# Altium project 定位NBIOT V1.2.PrjPCB
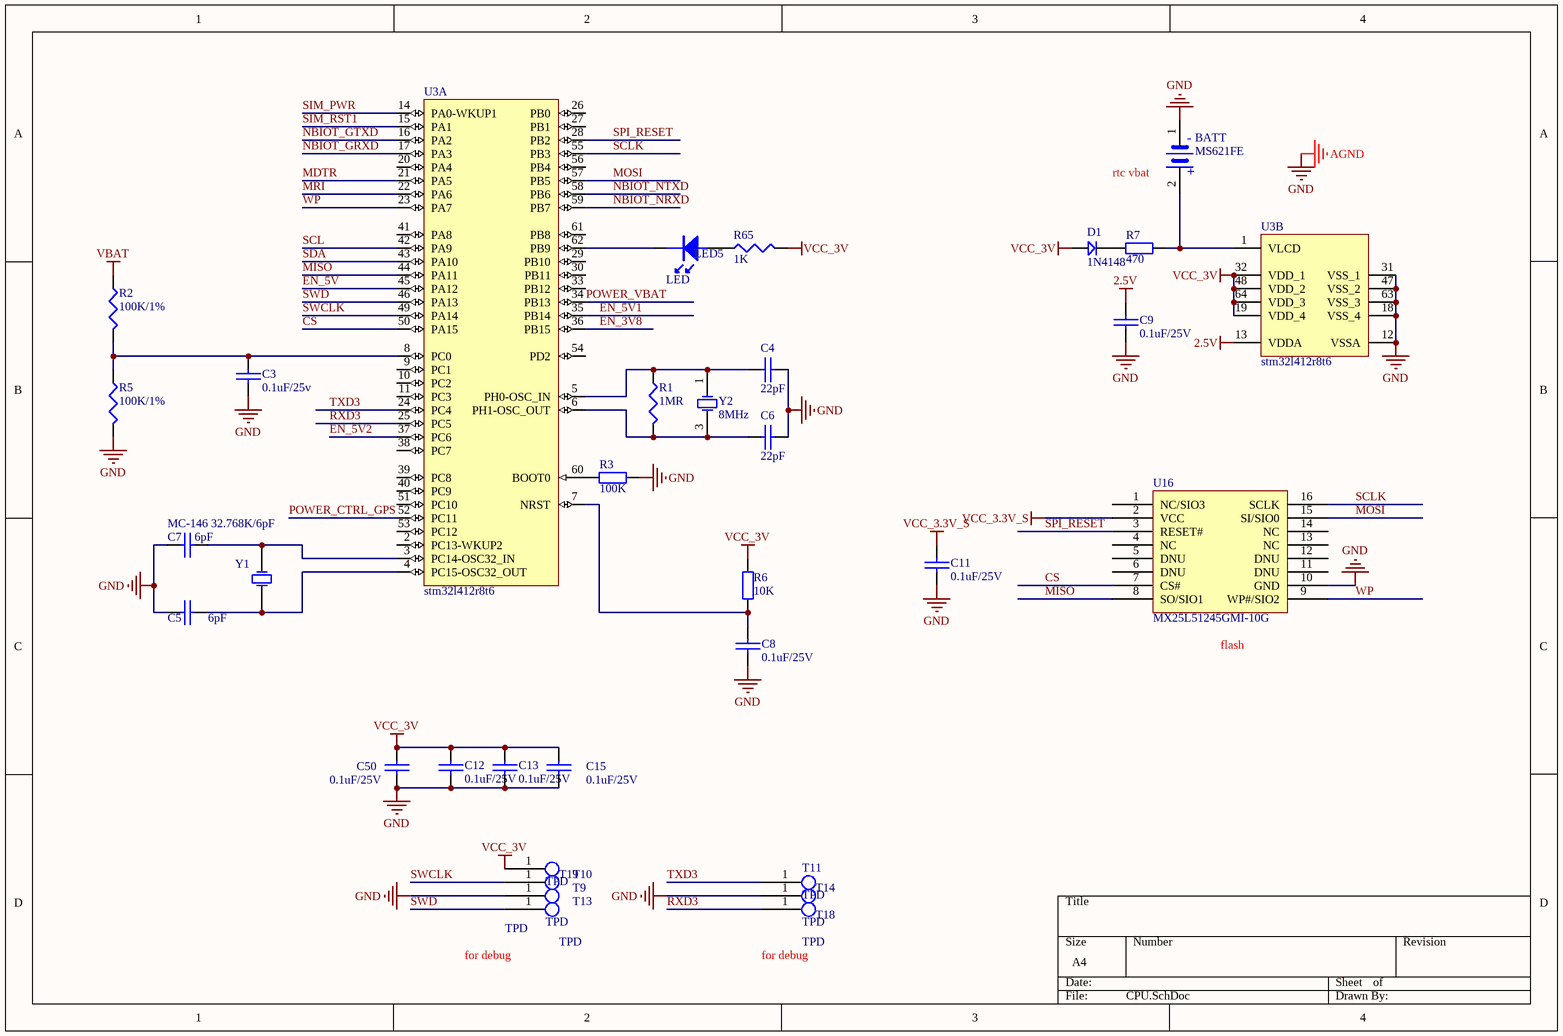
[diagram p0: CPU.SchDoc]
6 sheets, 149 parts. Net scope: global (net labels, ports and power ports of the same name join across sheets).
Board file: PCB1.1.PcbDoc
Sheets:
  CPU.SchDoc
  sensors.SchDoc
  power.SchDoc
  4G.SchDoc
  GPS&&lte2.SchDoc
  NBIOT.SchDoc

## Sheet CPU.SchDoc
size A4

### Parts
BATT  MS621FE  [MS621FE]
C3  0.1uF/25v  [0402c]
C4  22pF  [0402c]
C5  6pF  [0402c]
C6  22pF  [0402c]
C7  6pF  [0402c]
C8  0.1uF/25V  [0402C]
C9  0.1uF/25V  [0402C]
C11  0.1uF/25V  [0402C]
C12  0.1uF/25V  [0402C]
C13  0.1uF/25V  [0402C]
C15  0.1uF/25V  [0402C]
C50  0.1uF/25V  [0402C]
D1  1N4148  [DIODE_SOP]
LED5  LED  [0603LED]
R1  1MR  [0402R]
R2  100K/1%  [0402R]
R3  100K  [0402R]
R5  100K/1%  [0402R]
R6  10K  [0402R]
R7  470  [0402R]
R65  1K  [0402R]
T9  TPD  [TPd]
T10  TPD  [TPd]
T11  TPD  [TPd]
T13  TPD  [TPd]
T14  TPD  [TPd]
T18  TPD  [TPd]
T19  TPD  [TPd]
U3  stm32l412r8t6  [LQFP-64]  (parts A,B of 2)
U16  MX25L51245GMI-10G  [SOP127P1030X239-16N]
Y1  MC-146 32.768K/6pF  [32.768K]
Y2  8MHz  [OSCILLATOR-3.2X2.5]

### Nets
2.5V: C9.2 U3.13(VDDA)
AGND: BATT.1 C3.2 C4.1 C5.2 C6.1 C7.2 C8.1 C9.1 C11.1 C12.1 C13.1 C15.1 C50.1 R3.2 R5.2 T13.1 T14.1 U3.12(VSSA) U3.18(VSS_4) U3.31(VSS_1) U3.47(VSS_2) U3.63(VSS_3) U16.10(GND)  [also labelled GND]
VBAT: R2.1
VCC_3.3V_S: C11.2 U16.2(VCC)
VCC_3V: C12.2 C13.2 C15.2 C50.2 D1.1 R6.1 R65.2 T19.1 U3.19(VDD_4) U3.32(VDD_1) U3.48(VDD_2) U3.64(VDD_3)
CS: U3.50(PA15) U16.7(CS#)
EN_3V8: U3.36(PB15)
EN_5V: U3.45(PA12)
EN_5V1: U3.35(PB14)
EN_5V2: U3.37(PC6)
MDTR: U3.21(PA5)
MISO: U3.44(PA11) U16.8(SO/SIO1)
MOSI: U3.57(PB5) U16.15(SI/SIO0)
MRI: U3.22(PA6)
NBIOT_GRXD: U3.17(PA3)
NBIOT_GTXD: U3.16(PA2)
NBIOT_NRXD: U3.59(PB7)
NBIOT_NTXD: U3.58(PB6)
POWER_CTRL_GPS: U3.52(PC11)
POWER_VBAT: U3.34(PB13)
RXD3: T18.1 U3.25(PC5)
SCL: U3.42(PA9)
SCLK: U3.55(PB3) U16.16(SCLK)
SDA: U3.43(PA10)
SIM_PWR: U3.14(PA0-WKUP1)
SIM_RST1: U3.15(PA1)
SPI_RESET: U3.28(PB2) U16.3(RESET#)
SWCLK: T10.1 U3.49(PA14)
SWD: T9.1 U3.46(PA13)
TXD3: T11.1 U3.24(PC4)
WP: U3.23(PA7) U16.9(WP#/SIO2)
NetBATT_2: BATT.2 R7.2 U3.1(VLCD)
NetC3_1: C3.1 R2.2 R5.1 U3.8(PC0)
NetC4_2: C4.2 R1.1 U3.5(PH0-OSC_IN) Y2.1(OSC1)
NetC5_1: C5.1 U3.4(PC15-OSC32_OUT) Y1.2(OSC2)
NetC6_2: C6.2 R1.2 U3.6(PH1-OSC_OUT) Y2.3(OSC2)
NetC7_1: C7.1 U3.3(PC14-OSC32_IN) Y1.1(OSC1)
NetC8_2: C8.2 R6.2 U3.7(NRST)
NetD1_2: D1.2 R7.1
NetLED5_1: LED5.1 R65.1
NetLED5_2: LED5.2 U3.62(PB9)
NetR3_1: R3.1 U3.60(BOOT0)

Not connected (* = marked no-connect by the designer): U3 2(PC13-WKUP2) 9(PC1) 10(PC2) 11(PC3) 20(PA4) 26(PB0) 27(PB1) 29(PB10) 30(PB11) 33(PB12) 38(PC7) 39(PC8) 40(PC9) 41(PA8) 51(PC10) 53(PC12) 54(PD2) 56(PB4) 61(PB8); U16 1(NC/SIO3) 4(NC) 5(DNU) 6(DNU) 11(DNU) 12(DNU) 13(NC) 14(NC)

### Notes on the sheet
- (near BATT) rtc vbat
- (near U16) flash
- for debug
- (in symbol SBatery) -; +

### Library data of the parts
BATT = SBatery
C3-C9 C11-C13 C15 C50 = CAP: Capacitor
D1 = D
R1 = Res3: Resistor; Published: 8-Jun-2000; LatestRevisionDate: 29-May-2009; LatestRevisionNote: IPC-7351 Footprint Added.; PackageReference: J1-0603; Publisher: Altium Limited; PackageDescription: Chip Resistor
R2 R5 R65 = RES1: P: 1/8W
R3 R6 R7 = Res2: Resistor; Value: 1K; Published: 8-Jun-2000; LatestRevisionDate: 17-Jul-2002; LatestRevisionNote: Re-released for DXP Platform.; PackageReference: AXIAL-0.4; Publisher: Altium Limited
U3 = STM32L100R8T6: ARM Cortex-M3 32-bit MCU, 64 KB Flash, 8 KB Internal RAM, 51 I/Os, 64-pin LQFP, -40 to 85 degC, Tray; Manufacturer: STMicroelectronics; D/A Converter: 2x12-bit (2 Channel); Data E2PROM nom (B): 2048; Display controller: LCD 4x32/8x28; FLASH Size (Prog) (kB): 64; I/Os (High Current): 51; Internal RAM Size (kB): 8; Operating Frequency(F) (Processor speed) (MHz): 32; Supply Voltage(Vcc) min (V): 1.8; DatasheetVersion: Rev. 1; PackageVersion: Rev. 4, 06/2013; PackageReference: LQFP64; PackageDescription: 64-Pin Low Profile Quad Flat Package, 10 x 10 mm Body, 0.5 mm Pitch; Core: ARM Cortex-M3; Packing: Tray; Mounting Technology: Surface Mount; PartNumber: STM32L100R8T6; ComponentLink1Description: Manufacturer URL; ComponentLink1URL: http://www.st.com/web/en/home.html; ComponentLink2Description: Datasheet; ComponentLink2URL: http://www.st.com/st-web-ui/static/active/en/resource/technical/document/datasheet/DM00078075.pdf; ComponentLink3Description: Package Specification; ComponentLink3URL: http://www.st.com/st-web-ui/static/active/en/resource/technical/document/datasheet/DM00037051.pdf
Y1 Y2 = XTAL: Crystal Oscillator; Published: 8-Jun-2000; LatestRevisionDate: 17-Jul-2002; LatestRevisionNote: Re-released for DXP Platform.; PackageReference: R38; Publisher: Altium Limited
  Y2: PackageDescription: Crystal, Thru-Hole; 2 Leads; Body 3.1 x 8.2 mm (Dia.xH)

## Sheet sensors.SchDoc
size A4
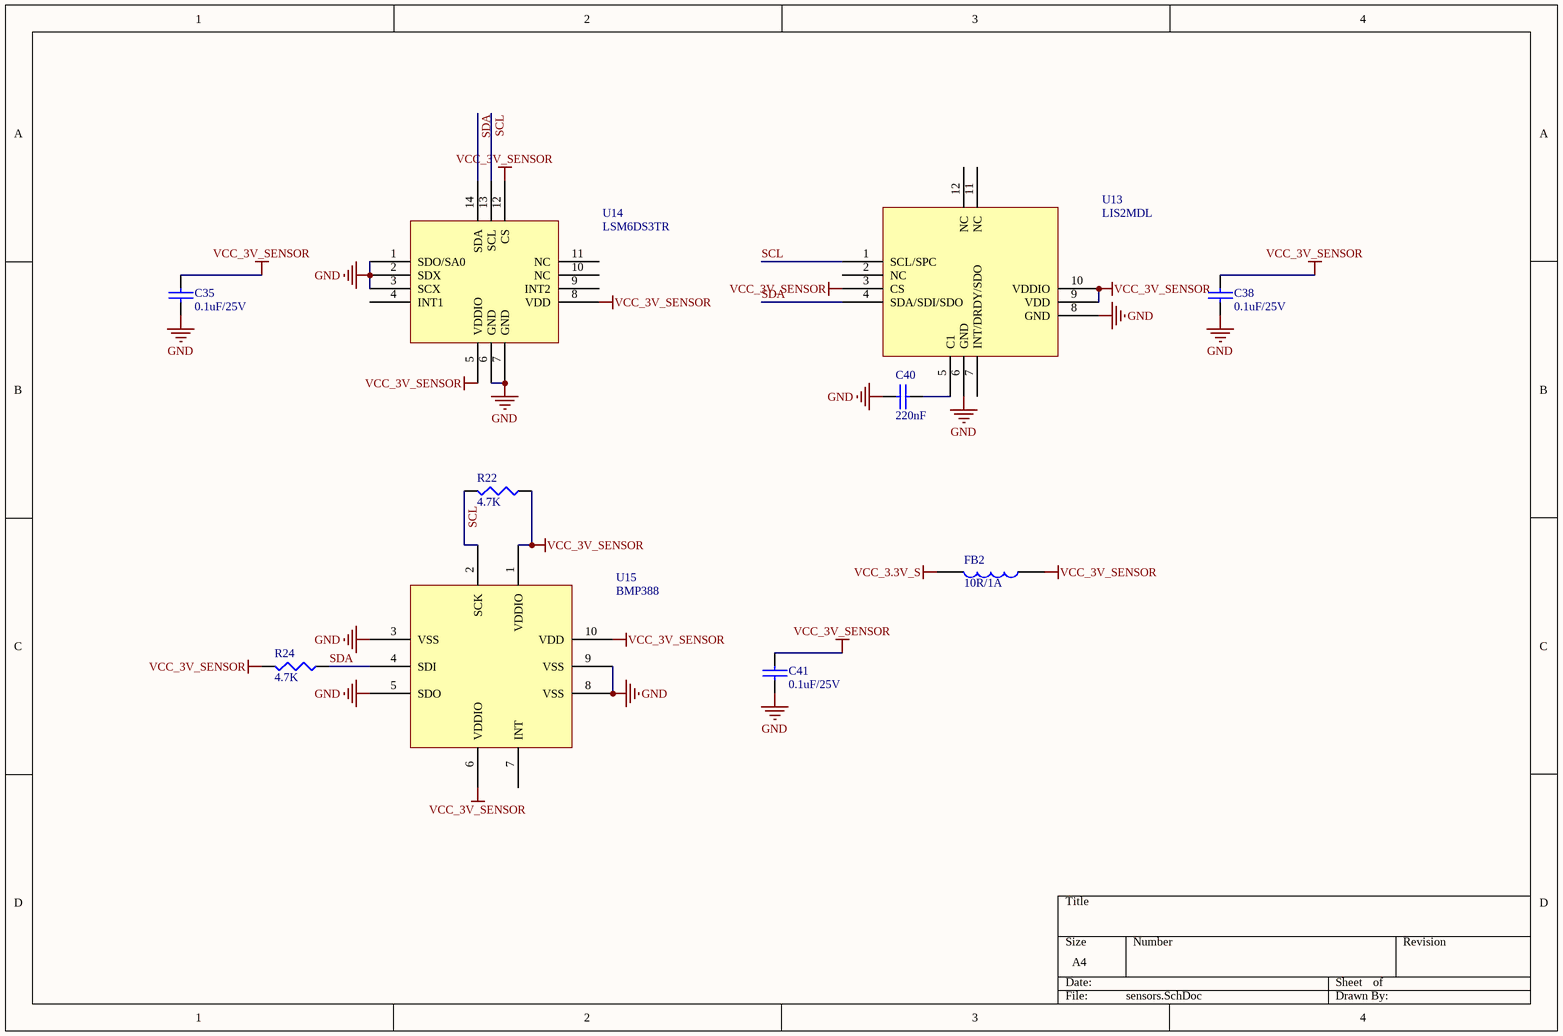
[diagram p1: sensors.SchDoc]

### Parts
C35  0.1uF/25V  [0402C]
C38  0.1uF/25V  [0402C]
C40  220nF  [0402c]
C41  0.1uF/25V  [0402C]
FB2  10R/1A  [0603R]
R22  4.7K  [0402R]
R24  4.7K  [0402R]
U13  LIS2MDL  [LIS2MDL]
U14  LSM6DS3TR  [LSM6DS3TR-C]
U15  BMP388  [BMP388]

### Nets
GND: C35.1 C38.1 C40.2 C41.1 U13.6(GND) U13.8(GND) U14.1(SDO/SA0) U14.2(SDX) U14.3(SCX) U14.6(GND) U14.7(GND) U15.3(VSS) U15.5(SDO) U15.8(VSS) U15.9(VSS)  [project net AGND]
VCC_3.3V_S: FB2.1
VCC_3V_SENSOR: C35.2 C38.2 C41.2 FB2.2 R22.1 R24.2 U13.3(CS) U13.9(VDD) U13.10(VDDIO) U14.5(VDDIO) U14.8(VDD) U14.12(CS) U15.1(VDDIO) U15.6(VDDIO) U15.10(VDD)
SCL: R22.2 U13.1(SCL/SPC) U14.13(SCL) U15.2(SCK)
SDA: R24.1 U13.4(SDA/SDI/SDO) U14.14(SDA) U15.4(SDI)
NetC40_1: C40.1 U13.5(C1)

Not connected (* = marked no-connect by the designer): U13 2(NC) 7(INT/DRDY/SDO) 11(NC) 12(NC); U14 4(INT1) 9(INT2) 10(NC) 11(NC); U15 7(INT)

### Library data of the parts
C35 C38 C40 C41 = CAP: Capacitor
FB2 = INDUCTOR1
R22 R24 = RES1: P: 1/8W

## Sheet power.SchDoc
size A3
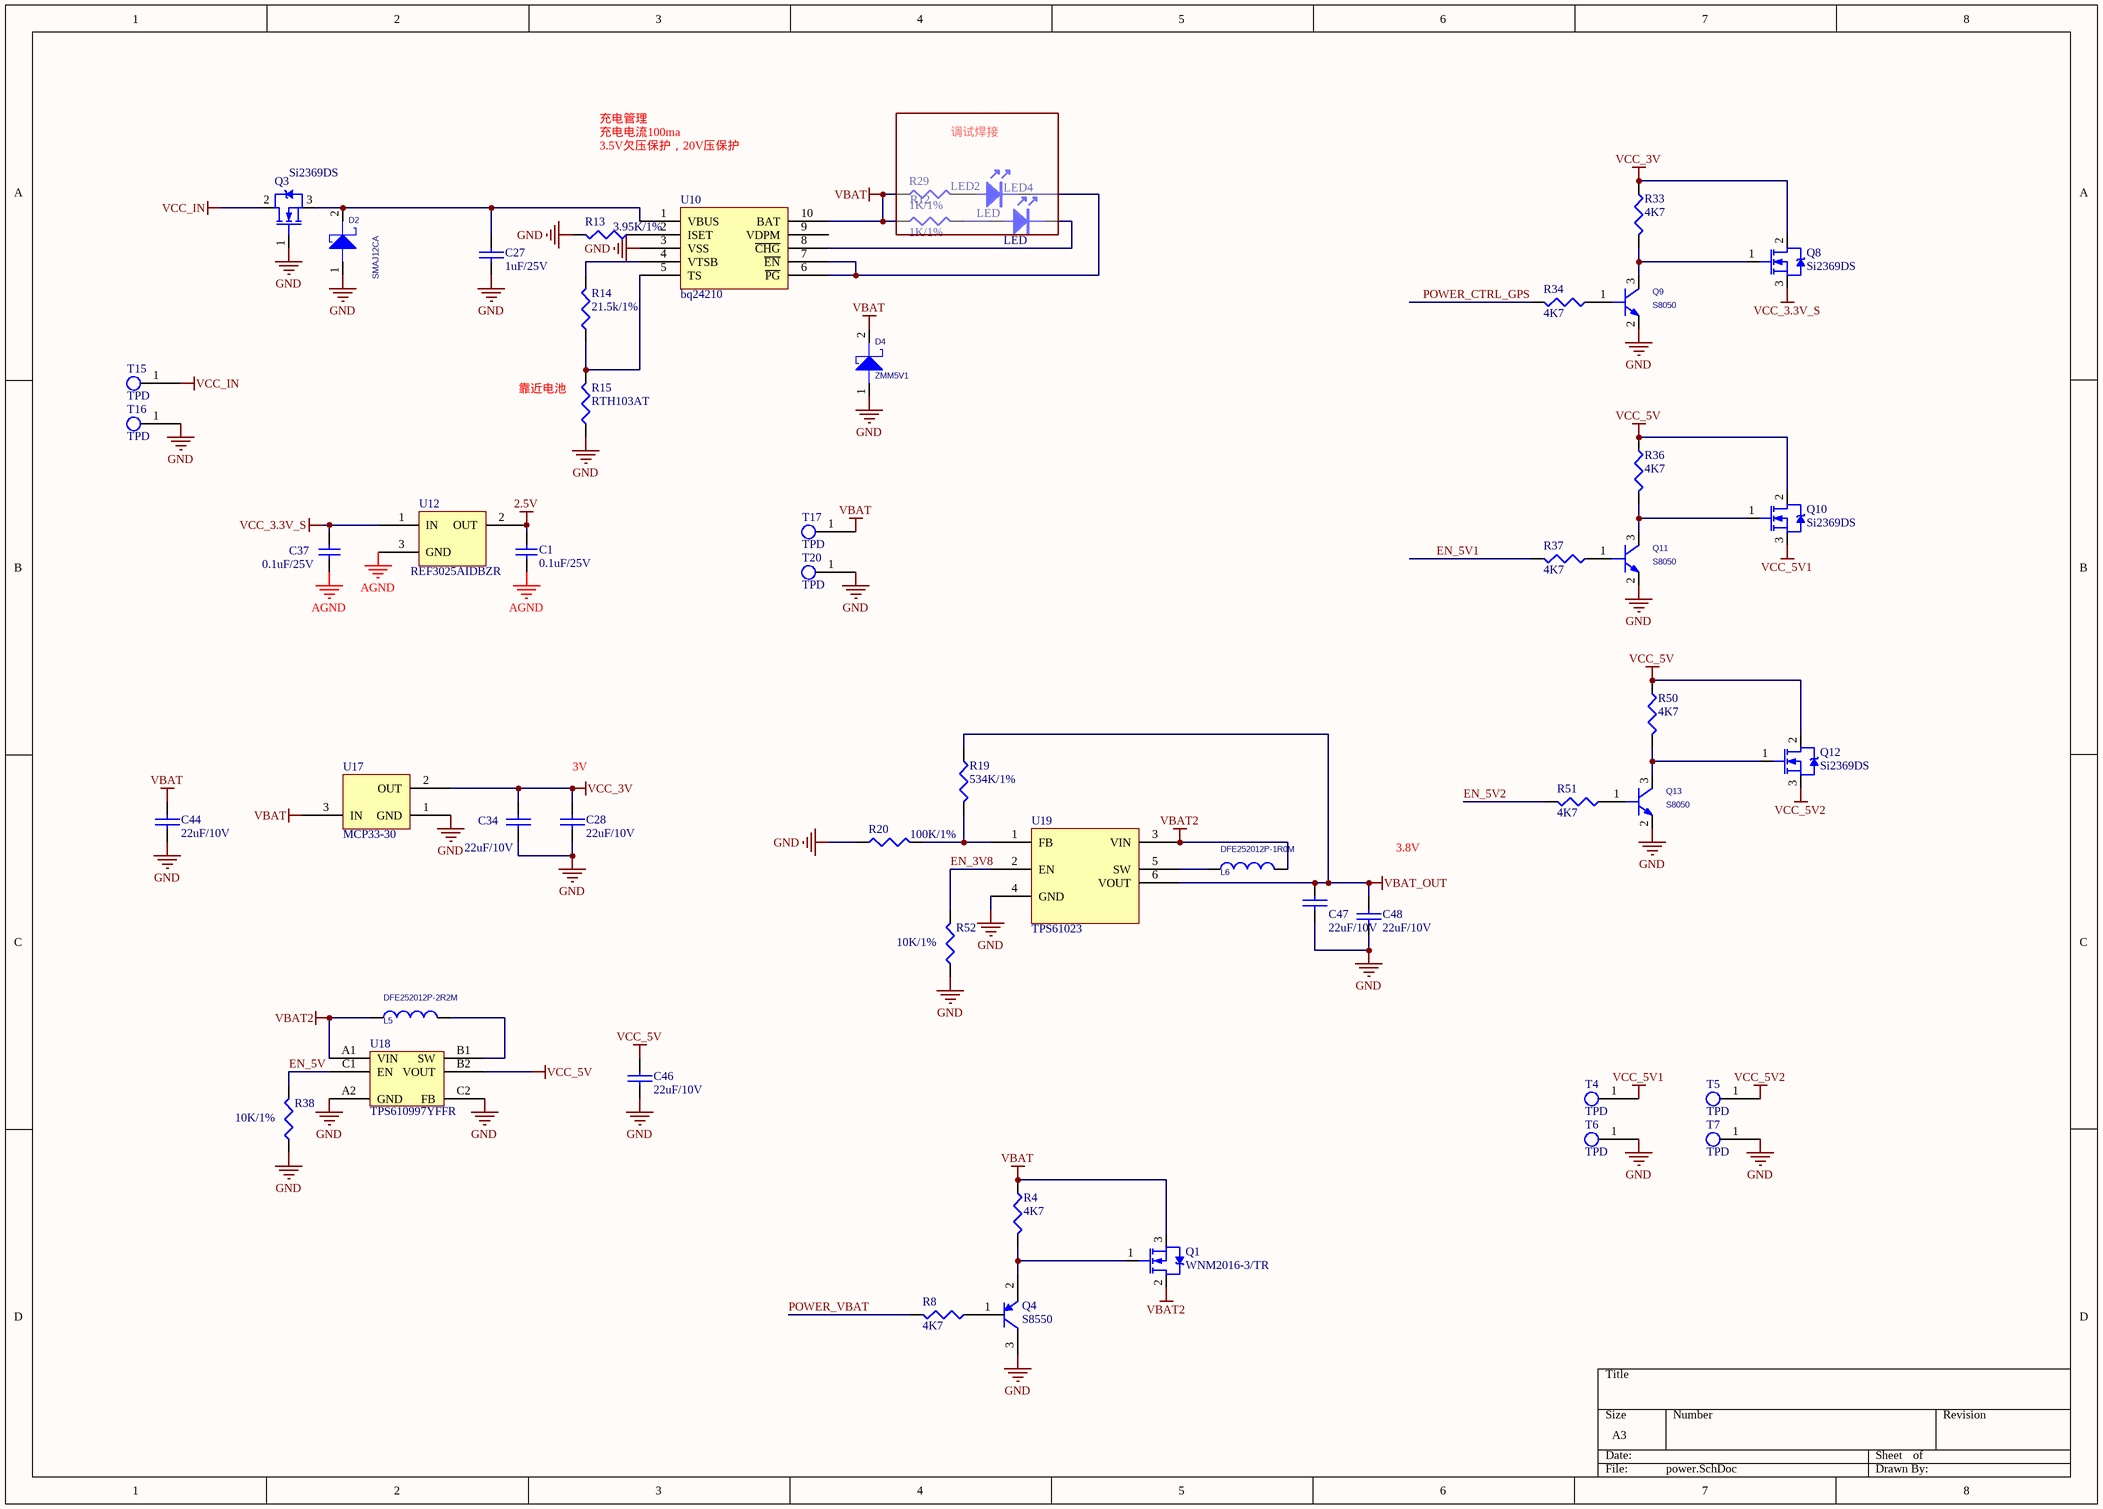
[diagram p2: power.SchDoc]

### Parts
C1  0.1uF/25V  [0402c]
C27  1uF/25V  [0402C]
C28  22uF/10V  [0805C]
C34  22uF/10V  [0805C]
C37  0.1uF/25V  [0402c]
C44  22uF/10V  [0805C]
C46  22uF/10V  [0805C]
C47  22uF/10V  [0805C]
C48  22uF/10V  [0805C]
D2  SMAJ12CA  [SMA]
D4  value ZMM5V1  [LL-34(D1206)]  (hidden comment: DIODE_SCHOTTKY_0)
L5  DFE252012P-2R2M  [L2520]
L6  DFE252012P-1R0M  [L2520]
LED2  LED  [0603LED]
LED4  LED  [0603LED]
Q1  WNM2016-3/TR  [sot23-3]
Q3  Si2369DS  [sot23-3]
Q4  S8550  [SOT95P240-3N]
Q8  Si2369DS  [sot23-3]
Q9  S8050  [SOT23-3]
Q10  Si2369DS  [sot23-3]
Q11  S8050  [SOT23-3]
Q12  Si2369DS  [sot23-3]
Q13  S8050  [SOT23-3]
R4  4K7  [0402R]
R8  4K7  [0402R]
R12  1K/1%  [0402R]
R13  3.95K/1%  [0402R]
R14  21.5k/1%  [0402R]
R15  RTH103AT  [0603R]
R19  534K/1%  [0402R]
R20  100K/1%  [0402R]
R29  1K/1%  [0402R]
R33  4K7  [0402R]
R34  4K7  [0402R]
R36  4K7  [0402R]
R37  4K7  [0402R]
R38  10K/1%  [0402R]
R50  4K7  [0402R]
R51  4K7  [0402R]
R52  10K/1%  [0402R]
T4  TPD  [TP]
T5  TPD  [TP]
T6  TPD  [TP]
T7  TPD  [TP]
T15  TPD  [TP]
T16  TPD  [TP]
T17  TPD  [TP]
T20  TPD  [TP]
U10  bq24210  [QFN50P200X300X80-10N]
U12  REF3025AIDBZR  [SOT23-3]
U17  MCP33-30  [SOT23-3]
U18  TPS610997YFFR  [TPS610997YFFR]
U19  TPS61023  [SOT563-6]

### Blocks framed on the sheet
调试焊接: LED2 LED4 R12 R29

### Nets
2.5V: C1.1 U12.2(OUT)
AGND: C1.2 C27.2 C28.2 C34.2 C37.2 C44.2 C46.2 C47.2 C48.2 D2.1 D4.1 Q3.1(G) Q4.3(C) Q9.2(E) Q11.2(E) Q13.2(E) R13.2 R15.1 R20.1 R38.1 R52.1 T6.1 T7.1 T16.1 T20.1 U10.3(VSS) U12.3(GND) U17.1(GND) U18.A2(GND) U18.C2(FB) U19.4(GND)  [also labelled GND]
VBAT: C44.1 D4.2 Q1.3(S) R4.1 R12.1 R29.1 T17.1 U10.10(BAT) U17.3(IN)
VBAT2: L5.1 L6.2 Q1.2(D) U18.A1(VIN) U19.3(VIN)
VBAT_OUT: C47.1 C48.1 R19.1 U19.6(VOUT)
VCC_3.3V_S: C37.1 Q8.3(S) U12.1(IN)
VCC_3V: C28.1 C34.1 Q8.2(D) R33.1 U17.2(OUT)
VCC_5V: C46.1 Q10.2(D) Q12.2(D) R36.1 R50.1 U18.B2(VOUT)
VCC_5V1: Q10.3(S) T4.1
VCC_5V2: Q12.3(S) T5.1
VCC_IN: Q3.2(D) T15.1
EN_3V8: R52.2 U19.2(EN)
EN_5V: R38.2 U18.C1(EN)
EN_5V1: R37.2
EN_5V2: R51.2
POWER_CTRL_GPS: R34.2
POWER_VBAT: R8.2
NetC27_1: C27.1 D2.2 Q3.3(S) U10.1(VBUS)
NetL5_2: L5.2 U18.B1(SW)
NetL6_1: L6.1 U19.5(SW)
NetLED2_1: LED2.1 R29.2
NetLED2_2: LED2.2 U10.6(~{PG}) U10.7(~{EN})
NetLED4_1: LED4.1 R12.2
NetLED4_2: LED4.2 U10.8(~{CHG})
NetQ1_1: Q1.1(G) Q4.2(E) R4.2
NetQ4_1: Q4.1(B) R8.1
NetQ8_1: Q8.1(G) Q9.3(C) R33.2
NetQ9_1: Q9.1(B) R34.1
NetQ10_1: Q10.1(G) Q11.3(C) R36.2
NetQ11_1: Q11.1(B) R37.1
NetQ12_1: Q12.1(G) Q13.3(C) R50.2
NetQ13_1: Q13.1(B) R51.1
NetR13_1: R13.1 U10.2(ISET)
NetR14_1: R14.1 R15.2 U10.5(TS)
NetR14_2: R14.2 U10.4(VTSB)
NetR19_2: R19.2 R20.2 U19.1(FB)

Not connected (* = marked no-connect by the designer): U10 9(VDPM)

### Notes on the sheet
- 充电管理
- 充电电流100ma
- 3.5V欠压保护，20V压保护
- (near R15) 靠近电池
- (near C28) 3V
- 3.8V

### Library data of the parts
C1 C37 = Cap: Capacitor; Value: 0.1uF; Published: 8-Jun-2000; LatestRevisionDate: 17-Jul-2002; LatestRevisionNote: Re-released for DXP Platform.; PackageReference: RAD-0.3; Publisher: Altium Limited; PackageDescription: Radial Cap, Thru-Hole; 2 Leads; 0.3 in Pin Spacing
C27 C28 C34 C44 C46-C48 = CAP: Capacitor
D2 D4 = DIODE_SCHOTTKY_0: PCB DECAL: DO_214AC; Source_Path: E:\AIH\WORK\A\LIBRARY1.OLB
  D2: Value: SMAJ12CA
L5 L6 = INDUCTOR_1
Q1 Q3 Q8 Q10 Q12 = NCE4060K: NMOSFET
Q4 = PNP: PNP Bipolar Transistor; Published: 8-Jun-2000; LatestRevisionDate: 29-May-2009; LatestRevisionNote: IPC-7351 Footprint Added.; PackageVersion: Aug-1999; PackageReference: SOT-23B; Publisher: Altium Limited; PackageDescription: 3-Pin SOT-23 Package 0.95 mm Pitch, 2.4 mm Lead Span
Q9 Q11 Q13 = 2N1069_1: PspiceTemplate: Q^@REFDES %C %B %E
R4 R8 R12-R15 R19 R20 R29 R33 R34 R36-R38 R50-R52 = RES1: P: 1/8W
U10 = bq2410
U12 U17 = REF3012

## Sheet 4G.SchDoc
size A2

## Sheet GPS&&lte2.SchDoc
size A2
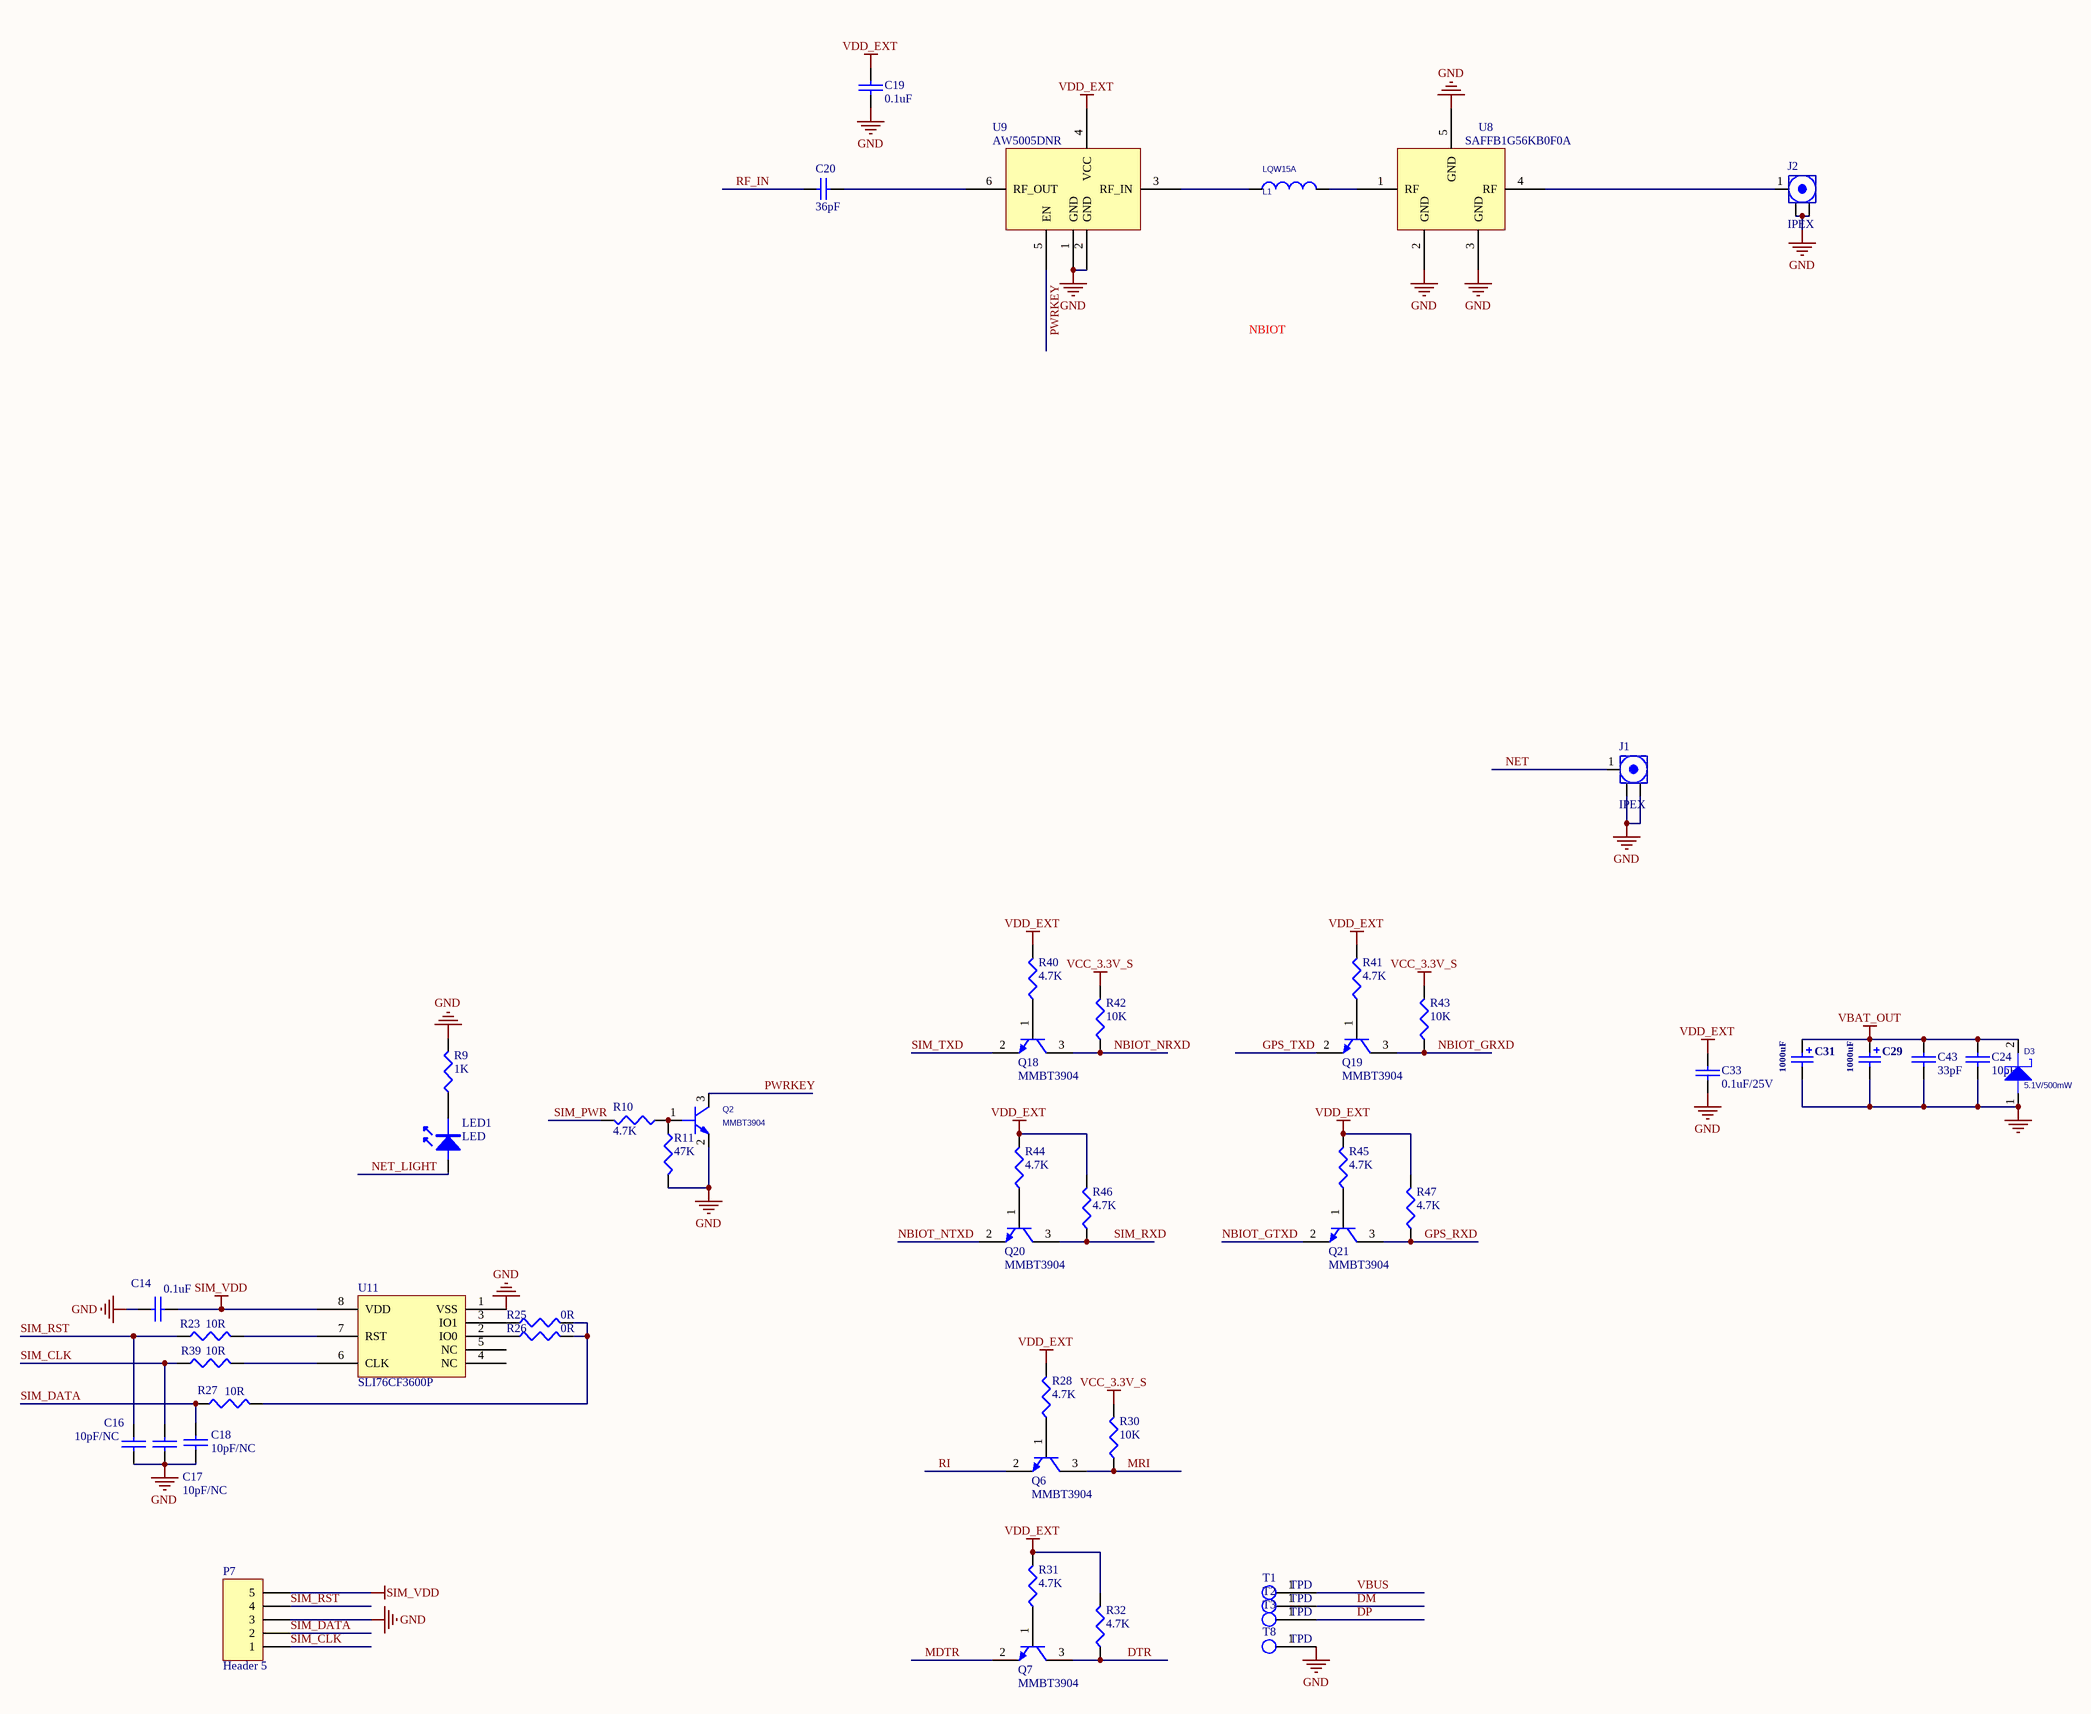
[diagram p3: GPS&&lte2.SchDoc]

### Parts
C14  0.1uF  [0402C]
C16  10pF/NC  [0402C]
C17  10pF/NC  [0402C]
C18  10pF/NC  [0402C]
C19  0.1uF  [0402C]
C20  36pF  [0402c]
C24  10pF  [0402C]
C29  1000uF  [7343]
C31  1000uF  [7343]
C33  0.1uF/25V  [0402C]
C43  33pF  [0402C]
D3  value 5.1V/500mW  [LL-34(D1206)]  (hidden comment: DIODE_SCHOTTKY_0)
J1  IPEX  [RF-UFL]
J2  IPEX  [RF-UFL]
L1  LQW15A  [0402R]
LED1  LED  [0603LED]
P7  Header 5  [5×1.25mmSMT]
Q2  MMBT3904  [SOT23-3]
Q6  MMBT3904  [SOT23-3]
Q7  MMBT3904  [SOT23-3]
Q18  MMBT3904  [SOT23-3]
Q19  MMBT3904  [SOT23-3]
Q20  MMBT3904  [SOT23-3]
Q21  MMBT3904  [SOT23-3]
R9  1K  [0402R]
R10  4.7K  [0402R]
R11  47K  [0402R]
R23  10R  [0402R]
R25  0R  [0402R]
R26  0R  [0402R]
R27  10R  [0402R]
R28  4.7K  [0402R]
R30  10K  [0402R]
R31  4.7K  [0402R]
R32  4.7K  [0402R]
R39  10R  [0402R]
R40  4.7K  [0402R]
R41  4.7K  [0402R]
R42  10K  [0402R]
R43  10K  [0402R]
R44  4.7K  [0402R]
R45  4.7K  [0402R]
R46  4.7K  [0402R]
R47  4.7K  [0402R]
T1  TPD  [TPD]
T2  TPD  [TPD]
T3  TPD  [TPD]
T8  TPD  [TPD]
U8  SAFFB1G56KB0F0A  [SAFFB1G56KB0F0A]
U9  AW5005DNR  [AW5005]
U11  SLI76CF3600P  [QFN127P500X600X80-8N]

### Nets
GND: C14.1 C16.1 C17.1 C18.1 C19.1 C24.1 C29.2 C31.2 C33.1 C43.1 D3.1 J1.2(Y) J2.2(Y) P7.3 Q2.2(E) R9.2 R11.2 T8.1 U8.2(GND) U8.3(GND) U8.5(GND) U9.1(GND) U9.2(GND) U11.1(VSS)  [project net AGND]
SIM_VDD: C14.2 P7.5 U11.8(VDD)
VBAT_OUT: C24.2 C29.1 C31.1 C43.2 D3.2
VCC_3.3V_S: R30.2 R42.2 R43.2
VDD_EXT: C19.2 C33.2 R28.2 R31.2 R32.2 R40.2 R41.2 R44.2 R45.2 R46.2 R47.2 U9.4(VCC)
DM: T2.1
DP: T3.1
DTR: Q7.3(C) R32.1
GPS_RXD: Q21.3(C) R47.1
GPS_TXD: Q19.2(E)
MDTR: Q7.2(E)
MRI: Q6.3(C) R30.1
NBIOT_GRXD: Q19.3(C) R43.1
NBIOT_GTXD: Q21.2(E)
NBIOT_NRXD: Q18.3(C) R42.1
NBIOT_NTXD: Q20.2(E)
NET: J1.1(X)
NET_LIGHT: LED1.1
PWRKEY: Q2.3(C) U9.5(EN)
RF_IN: C20.1
RI: Q6.2(E)
SIM_CLK: C17.2 P7.1 R39.1
SIM_DATA: C18.2 P7.2 R27.1
SIM_PWR: R10.2
SIM_RST: C16.2 P7.4 R23.1
SIM_RXD: Q20.3(C) R46.1
SIM_TXD: Q18.2(E)
VBUS: T1.1
NetC20_2: C20.2 U9.6(RF_OUT)
NetJ2_1: J2.1(X) U8.4(RF)
NetL1_1: L1.1 U9.3(RF_IN)
NetL1_2: L1.2 U8.1(RF)
NetLED1_2: LED1.2 R9.1
NetQ2_1: Q2.1(B) R10.1 R11.1
NetQ6_1: Q6.1(B) R28.1
NetQ7_1: Q7.1(B) R31.1
NetQ18_1: Q18.1(B) R40.1
NetQ19_1: Q19.1(B) R41.1
NetQ20_1: Q20.1(B) R44.1
NetQ21_1: Q21.1(B) R45.1
NetR23_2: R23.2 U11.7(RST)
NetR25_1: R25.1 U11.3(IO1)
NetR25_2: R25.2 R26.2 R27.2
NetR26_1: R26.1 U11.2(IO0)
NetR39_2: R39.2 U11.6(CLK)

Not connected (* = marked no-connect by the designer): U11 4(NC) 5(NC)

### Notes on the sheet
- NBIOT

### Library data of the parts
C14 C16-C19 C24 C33 C43 = CAP: Capacitor
C20 = Cap: Capacitor; Value: 0.1uF/10V; Published: 8-Jun-2000; LatestRevisionDate: 17-Jul-2002; LatestRevisionNote: Re-released for DXP Platform.; PackageReference: RAD-0.3; Publisher: Altium Limited
C29 C31 = Cap Pol3: Polarized Capacitor (Surface Mount); PackageReference: C10*10.2
D3 = DIODE_SCHOTTKY_0: as D2 on sheet power
J1 J2 = ANT
L1 = INDUCTOR_1
P7 = Header 5: Header, 5-Pin; LatestRevisionDate: 17-Jul-2002; LatestRevisionNote: Re-released for DXP Platform.; Publisher: Altium Limited
Q2 = 2N1069_1: PspiceTemplate: Q^@REFDES %C %B %E
Q6 Q7 Q18-Q21 = NPN
R9-R11 R23 R25-R28 R30-R32 R39-R47 = RES1: P: 1/8W
U8 = SAFFB1G56KBOFA

## Sheet NBIOT.SchDoc
size A3
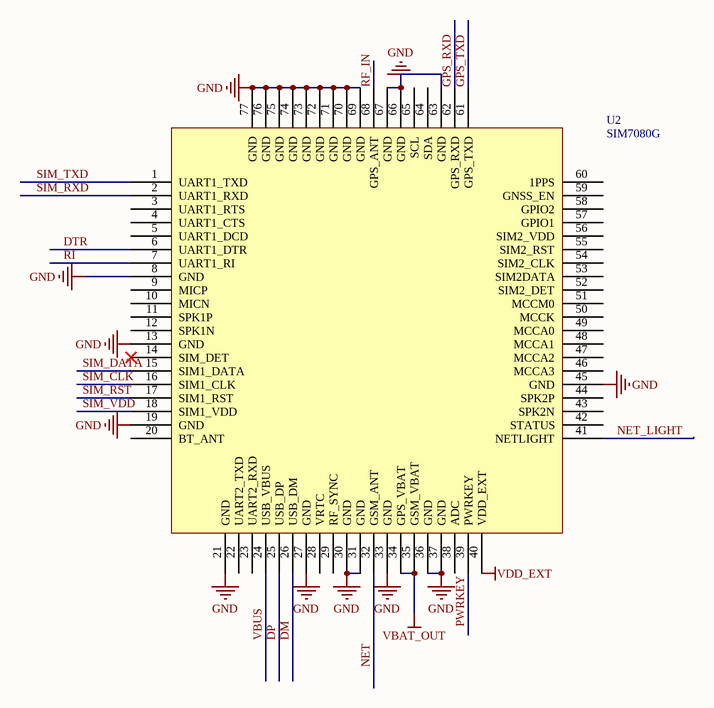
[diagram p4: NBIOT.SchDoc]

### Parts
U2  SIM7080G  [SIM868]

### Nets
GND: U2.8(GND) U2.13(GND) U2.19(GND) U2.21(GND) U2.27(GND) U2.30(GND) U2.31(GND) U2.33(GND) U2.36(GND) U2.37(GND) U2.45(GND) U2.63(GND) U2.66(GND) U2.67(GND) U2.69(GND) U2.70(GND) U2.71(GND) U2.72(GND) U2.73(GND) U2.74(GND) U2.75(GND) U2.76(GND) U2.77(GND)  [project net AGND]
SIM_VDD: U2.18(SIM1_VDD)
VBAT_OUT: U2.34(GPS_VBAT) U2.35(GSM_VBAT)
VDD_EXT: U2.40(VDD_EXT)
DM: U2.26(USB_DM)
DP: U2.25(USB_DP)
DTR: U2.6(UART1_DTR)
GPS_RXD: U2.62(GPS_RXD)
GPS_TXD: U2.61(GPS_TXD)
NET: U2.32(GSM_ANT)
NET_LIGHT: U2.41(NETLIGHT)
PWRKEY: U2.39(PWRKEY)
RF_IN: U2.68(GPS_ANT)
RI: U2.7(UART1_RI)
SIM_CLK: U2.16(SIM1_CLK)
SIM_DATA: U2.15(SIM1_DATA)
SIM_RST: U2.17(SIM1_RST)
SIM_RXD: U2.2(UART1_RXD)
SIM_TXD: U2.1(UART1_TXD)
VBUS: U2.24(USB_VBUS)

Not connected (* = marked no-connect by the designer): U2 3(UART1_RTS) 4(UART1_CTS) 5(UART1_DCD) 9(MICP) 10(MICN) 11(SPK1P) 12(SPK1N) 14(SIM_DET)* 20(BT_ANT) 22(UART2_TXD) 23(UART2_RXD) 28(VRTC) 29(RF_SYNC) 38(ADC) 42(STATUS) 43(SPK2N) 44(SPK2P) 46(MCCA3) 47(MCCA2) 48(MCCA1) 49(MCCA0) 50(MCCK) 51(MCCM0) 52(SIM2_DET) 53(SIM2DATA) 54(SIM2_CLK) 55(SIM2_RST) 56(SIM2_VDD) 57(GPIO1) 58(GPIO2) 59(GNSS_EN) 60(1PPS) 64(SDA) 65(SCL)

### Library data of the parts
U2 = SIM868E/SIM868

## Nets that join several sheets
2.5V: CPU (C9.2 U3.13), power (C1.1 U12.2)
AGND: CPU (23 pins), sensors (15 pins), power (31 pins), GPS&&lte2 (24 pins), NBIOT (23 pins)
SIM_VDD: GPS&&lte2 (C14.2 P7.5 U11.8), NBIOT (U2.18)
VBAT: CPU (R2.1), power (9 pins)
VBAT_OUT: power (C47.1 C48.1 R19.1 U19.6), GPS&&lte2 (5 pins), NBIOT (U2.34 U2.35)
VCC_3.3V_S: CPU (C11.2 U16.2), sensors (FB2.1), power (C37.1 Q8.3 U12.1), GPS&&lte2 (R30.2 R42.2 R43.2)
VCC_3V: CPU (12 pins), power (5 pins)
VDD_EXT: GPS&&lte2 (12 pins), NBIOT (U2.40)
DM: GPS&&lte2 (T2.1), NBIOT (U2.26)
DP: GPS&&lte2 (T3.1), NBIOT (U2.25)
DTR: GPS&&lte2 (Q7.3 R32.1), NBIOT (U2.6)
EN_3V8: CPU (U3.36), power (R52.2 U19.2)
EN_5V: CPU (U3.45), power (R38.2 U18.C1)
EN_5V1: CPU (U3.35), power (R37.2)
EN_5V2: CPU (U3.37), power (R51.2)
GPS_RXD: GPS&&lte2 (Q21.3 R47.1), NBIOT (U2.62)
GPS_TXD: GPS&&lte2 (Q19.2), NBIOT (U2.61)
MDTR: CPU (U3.21), GPS&&lte2 (Q7.2)
MRI: CPU (U3.22), GPS&&lte2 (Q6.3 R30.1)
NBIOT_GRXD: CPU (U3.17), GPS&&lte2 (Q19.3 R43.1)
NBIOT_GTXD: CPU (U3.16), GPS&&lte2 (Q21.2)
NBIOT_NRXD: CPU (U3.59), GPS&&lte2 (Q18.3 R42.1)
NBIOT_NTXD: CPU (U3.58), GPS&&lte2 (Q20.2)
NET: GPS&&lte2 (J1.1), NBIOT (U2.32)
NET_LIGHT: GPS&&lte2 (LED1.1), NBIOT (U2.41)
POWER_CTRL_GPS: CPU (U3.52), power (R34.2)
POWER_VBAT: CPU (U3.34), power (R8.2)
PWRKEY: GPS&&lte2 (Q2.3 U9.5), NBIOT (U2.39)
RF_IN: GPS&&lte2 (C20.1), NBIOT (U2.68)
RI: GPS&&lte2 (Q6.2), NBIOT (U2.7)
SCL: CPU (U3.42), sensors (R22.2 U13.1 U14.13 U15.2)
SDA: CPU (U3.43), sensors (R24.1 U13.4 U14.14 U15.4)
SIM_CLK: GPS&&lte2 (C17.2 P7.1 R39.1), NBIOT (U2.16)
SIM_DATA: GPS&&lte2 (C18.2 P7.2 R27.1), NBIOT (U2.15)
SIM_PWR: CPU (U3.14), GPS&&lte2 (R10.2)
SIM_RST: GPS&&lte2 (C16.2 P7.4 R23.1), NBIOT (U2.17)
SIM_RXD: GPS&&lte2 (Q20.3 R46.1), NBIOT (U2.2)
SIM_TXD: GPS&&lte2 (Q18.2), NBIOT (U2.1)
VBUS: GPS&&lte2 (T1.1), NBIOT (U2.24)